# EasyEDA Pro project ProPrj_Trimix_2026-09-05.epro

# Schematic Kretskort

## Sheets
1 ESP-32S: Board Name: Board v1; Create Date: 2025-07-03; Page Name: ESP-32S; Project Name: Trimix; Schematic Name: Schematic1; Update Date: 2026-01-29; Company: MAGSON; Page Size: A4; Version: V1.0
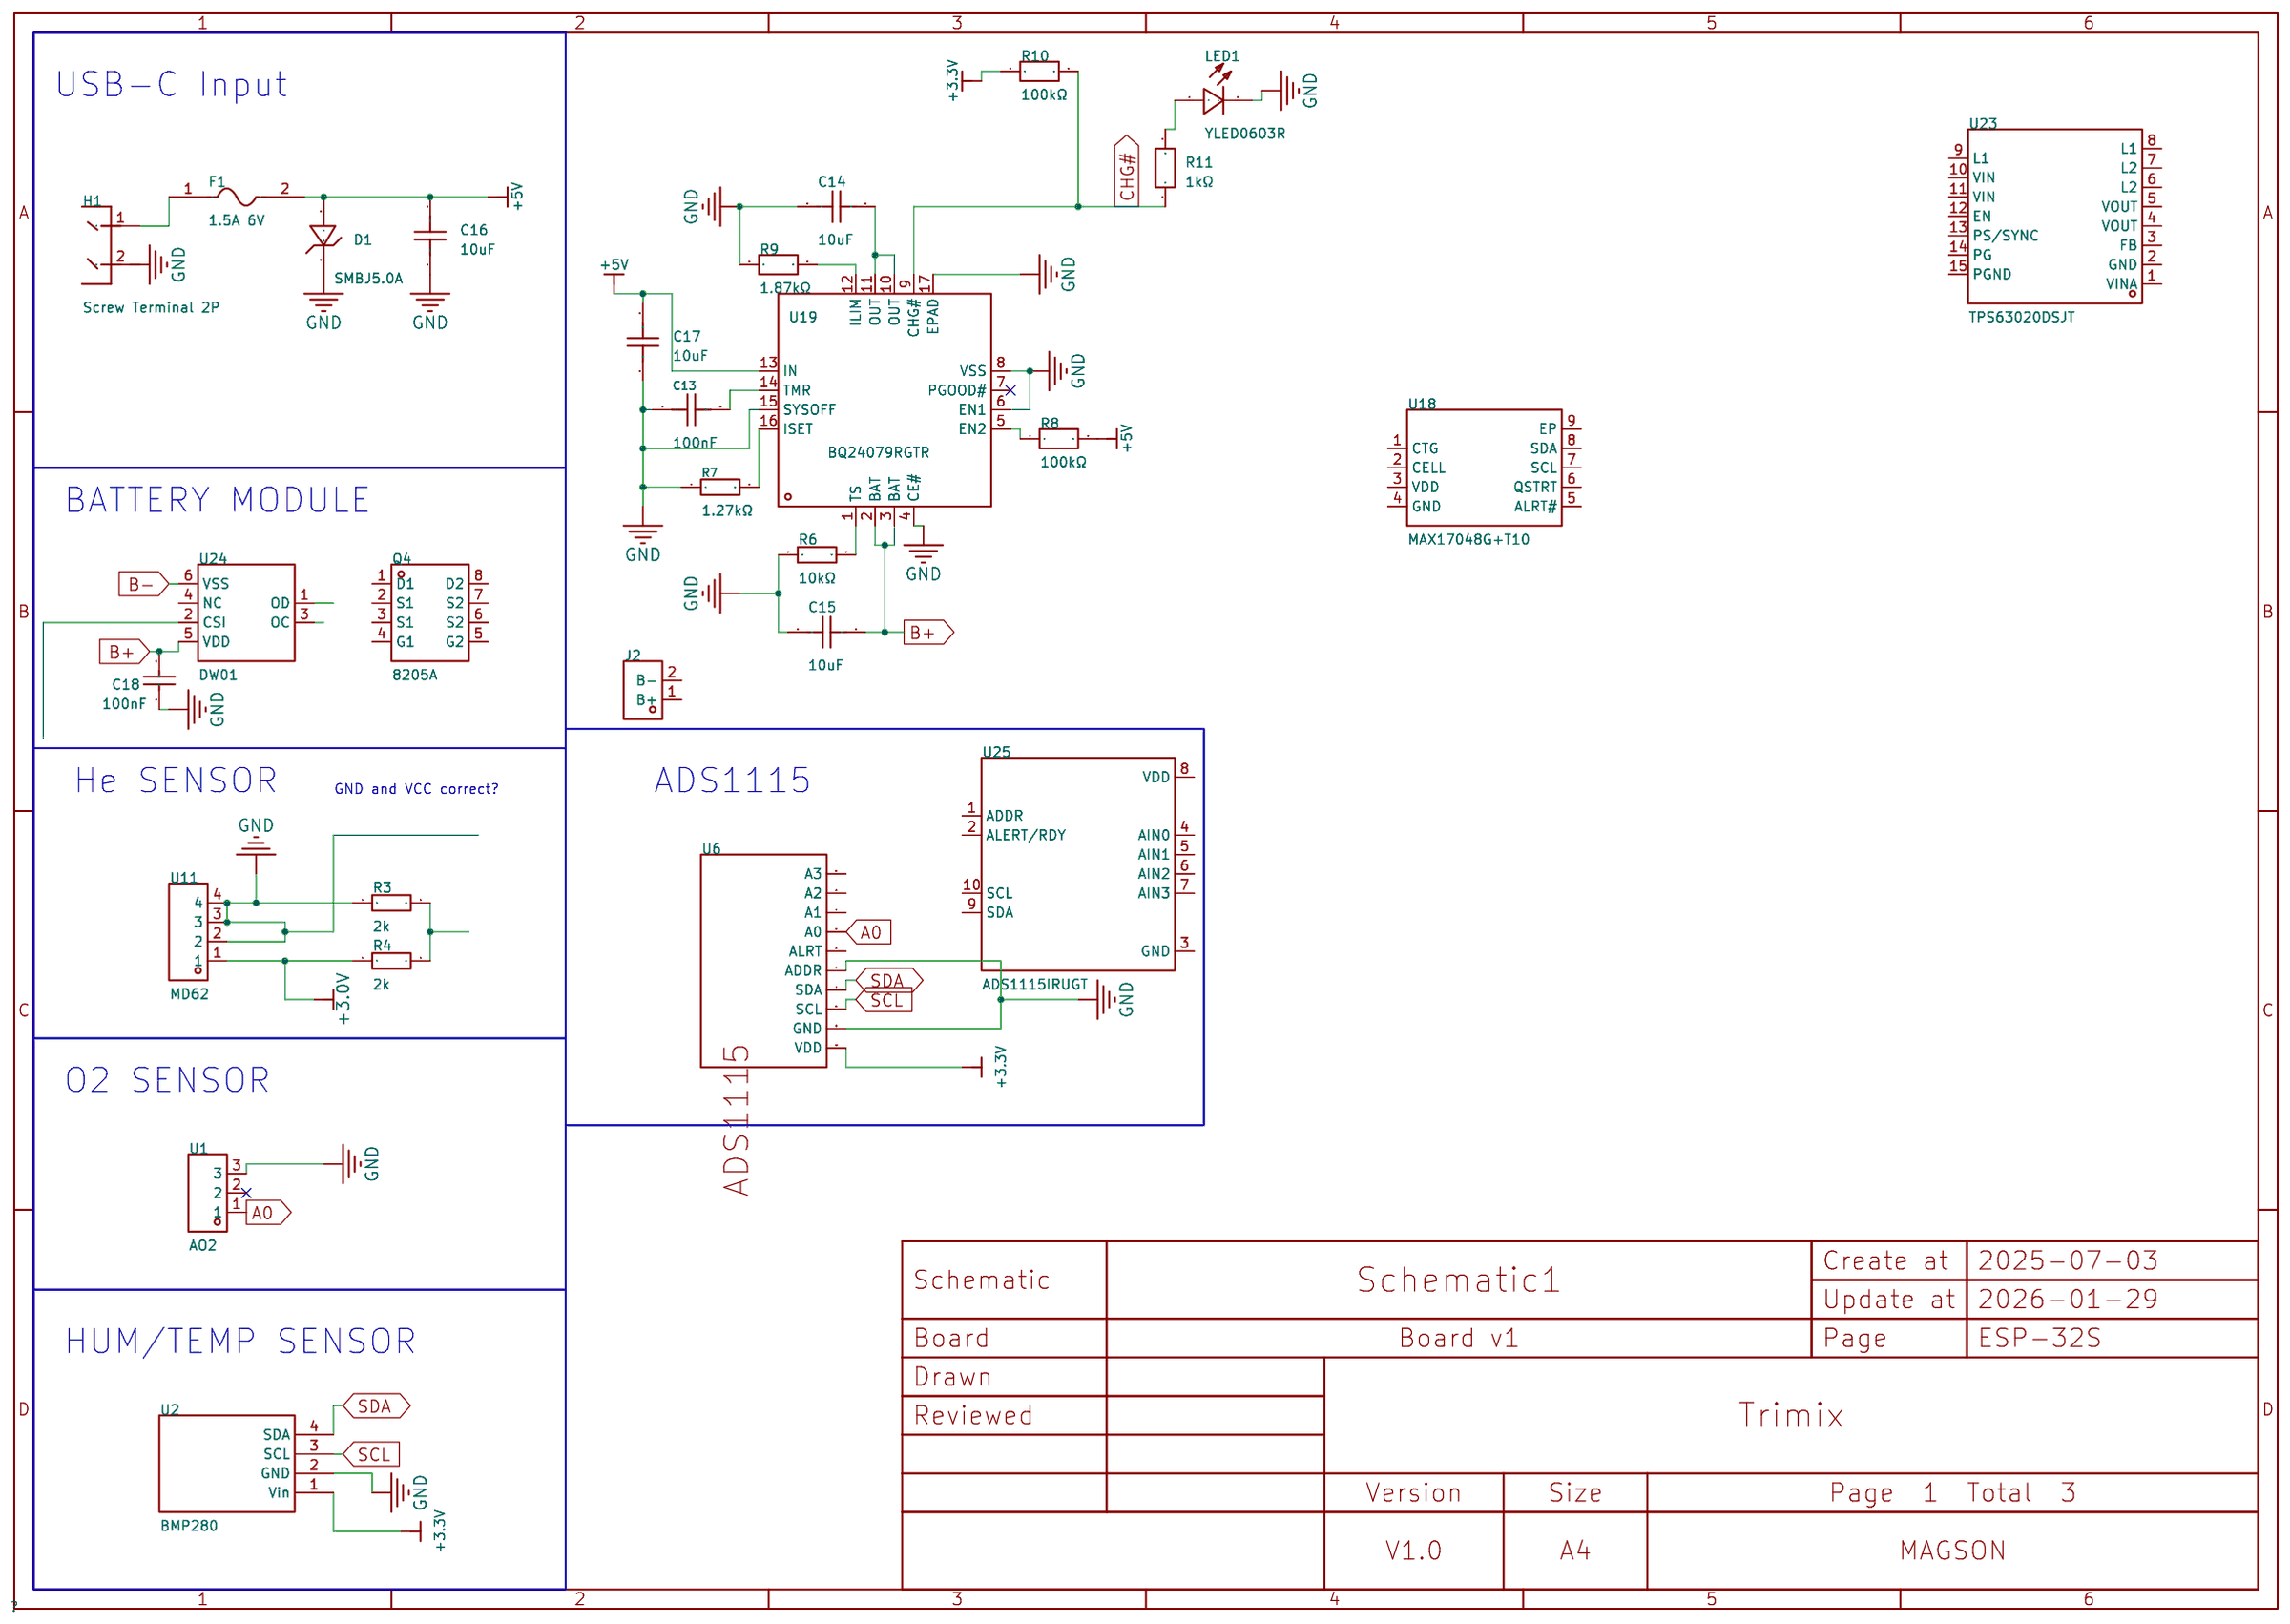
[diagram p0: ESP-32S]
2 Arduino nano_1: Board Name: Board1; Page Name: Arduino nano; Update Date: 2025-07-05; Company: EasyEDA.com
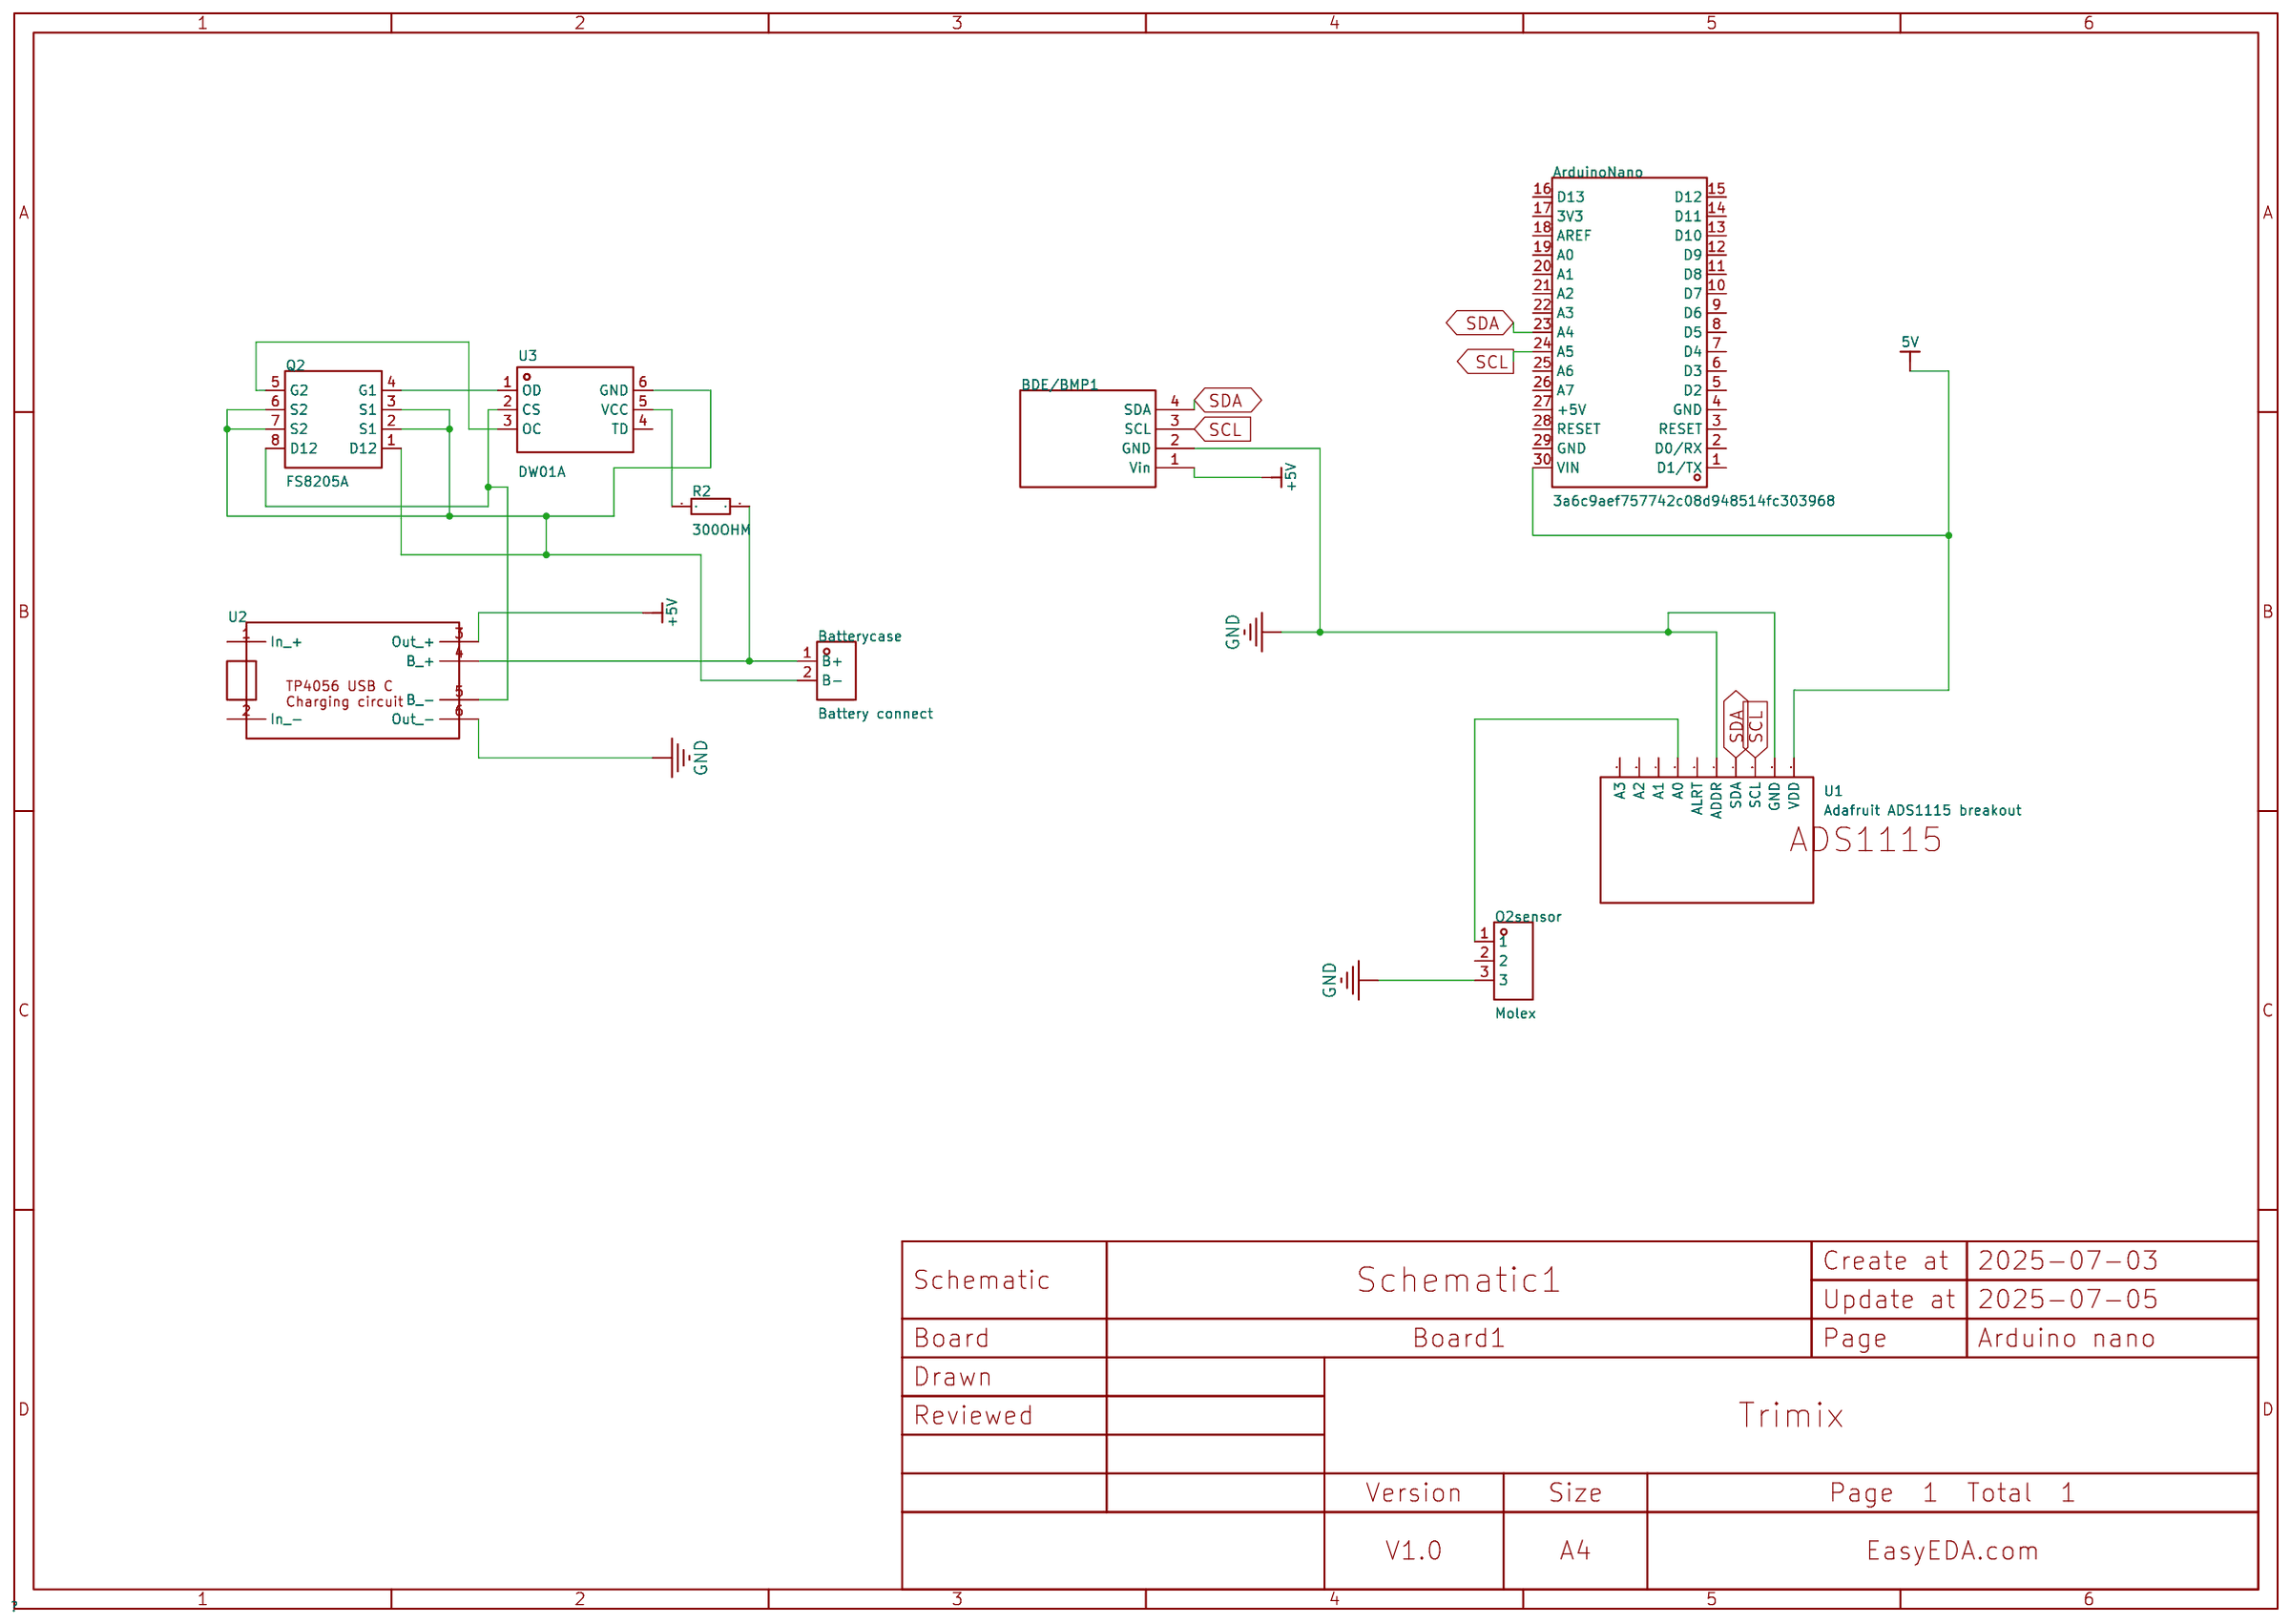
[diagram p1: Arduino nano_1]
3 ESP-32S backup
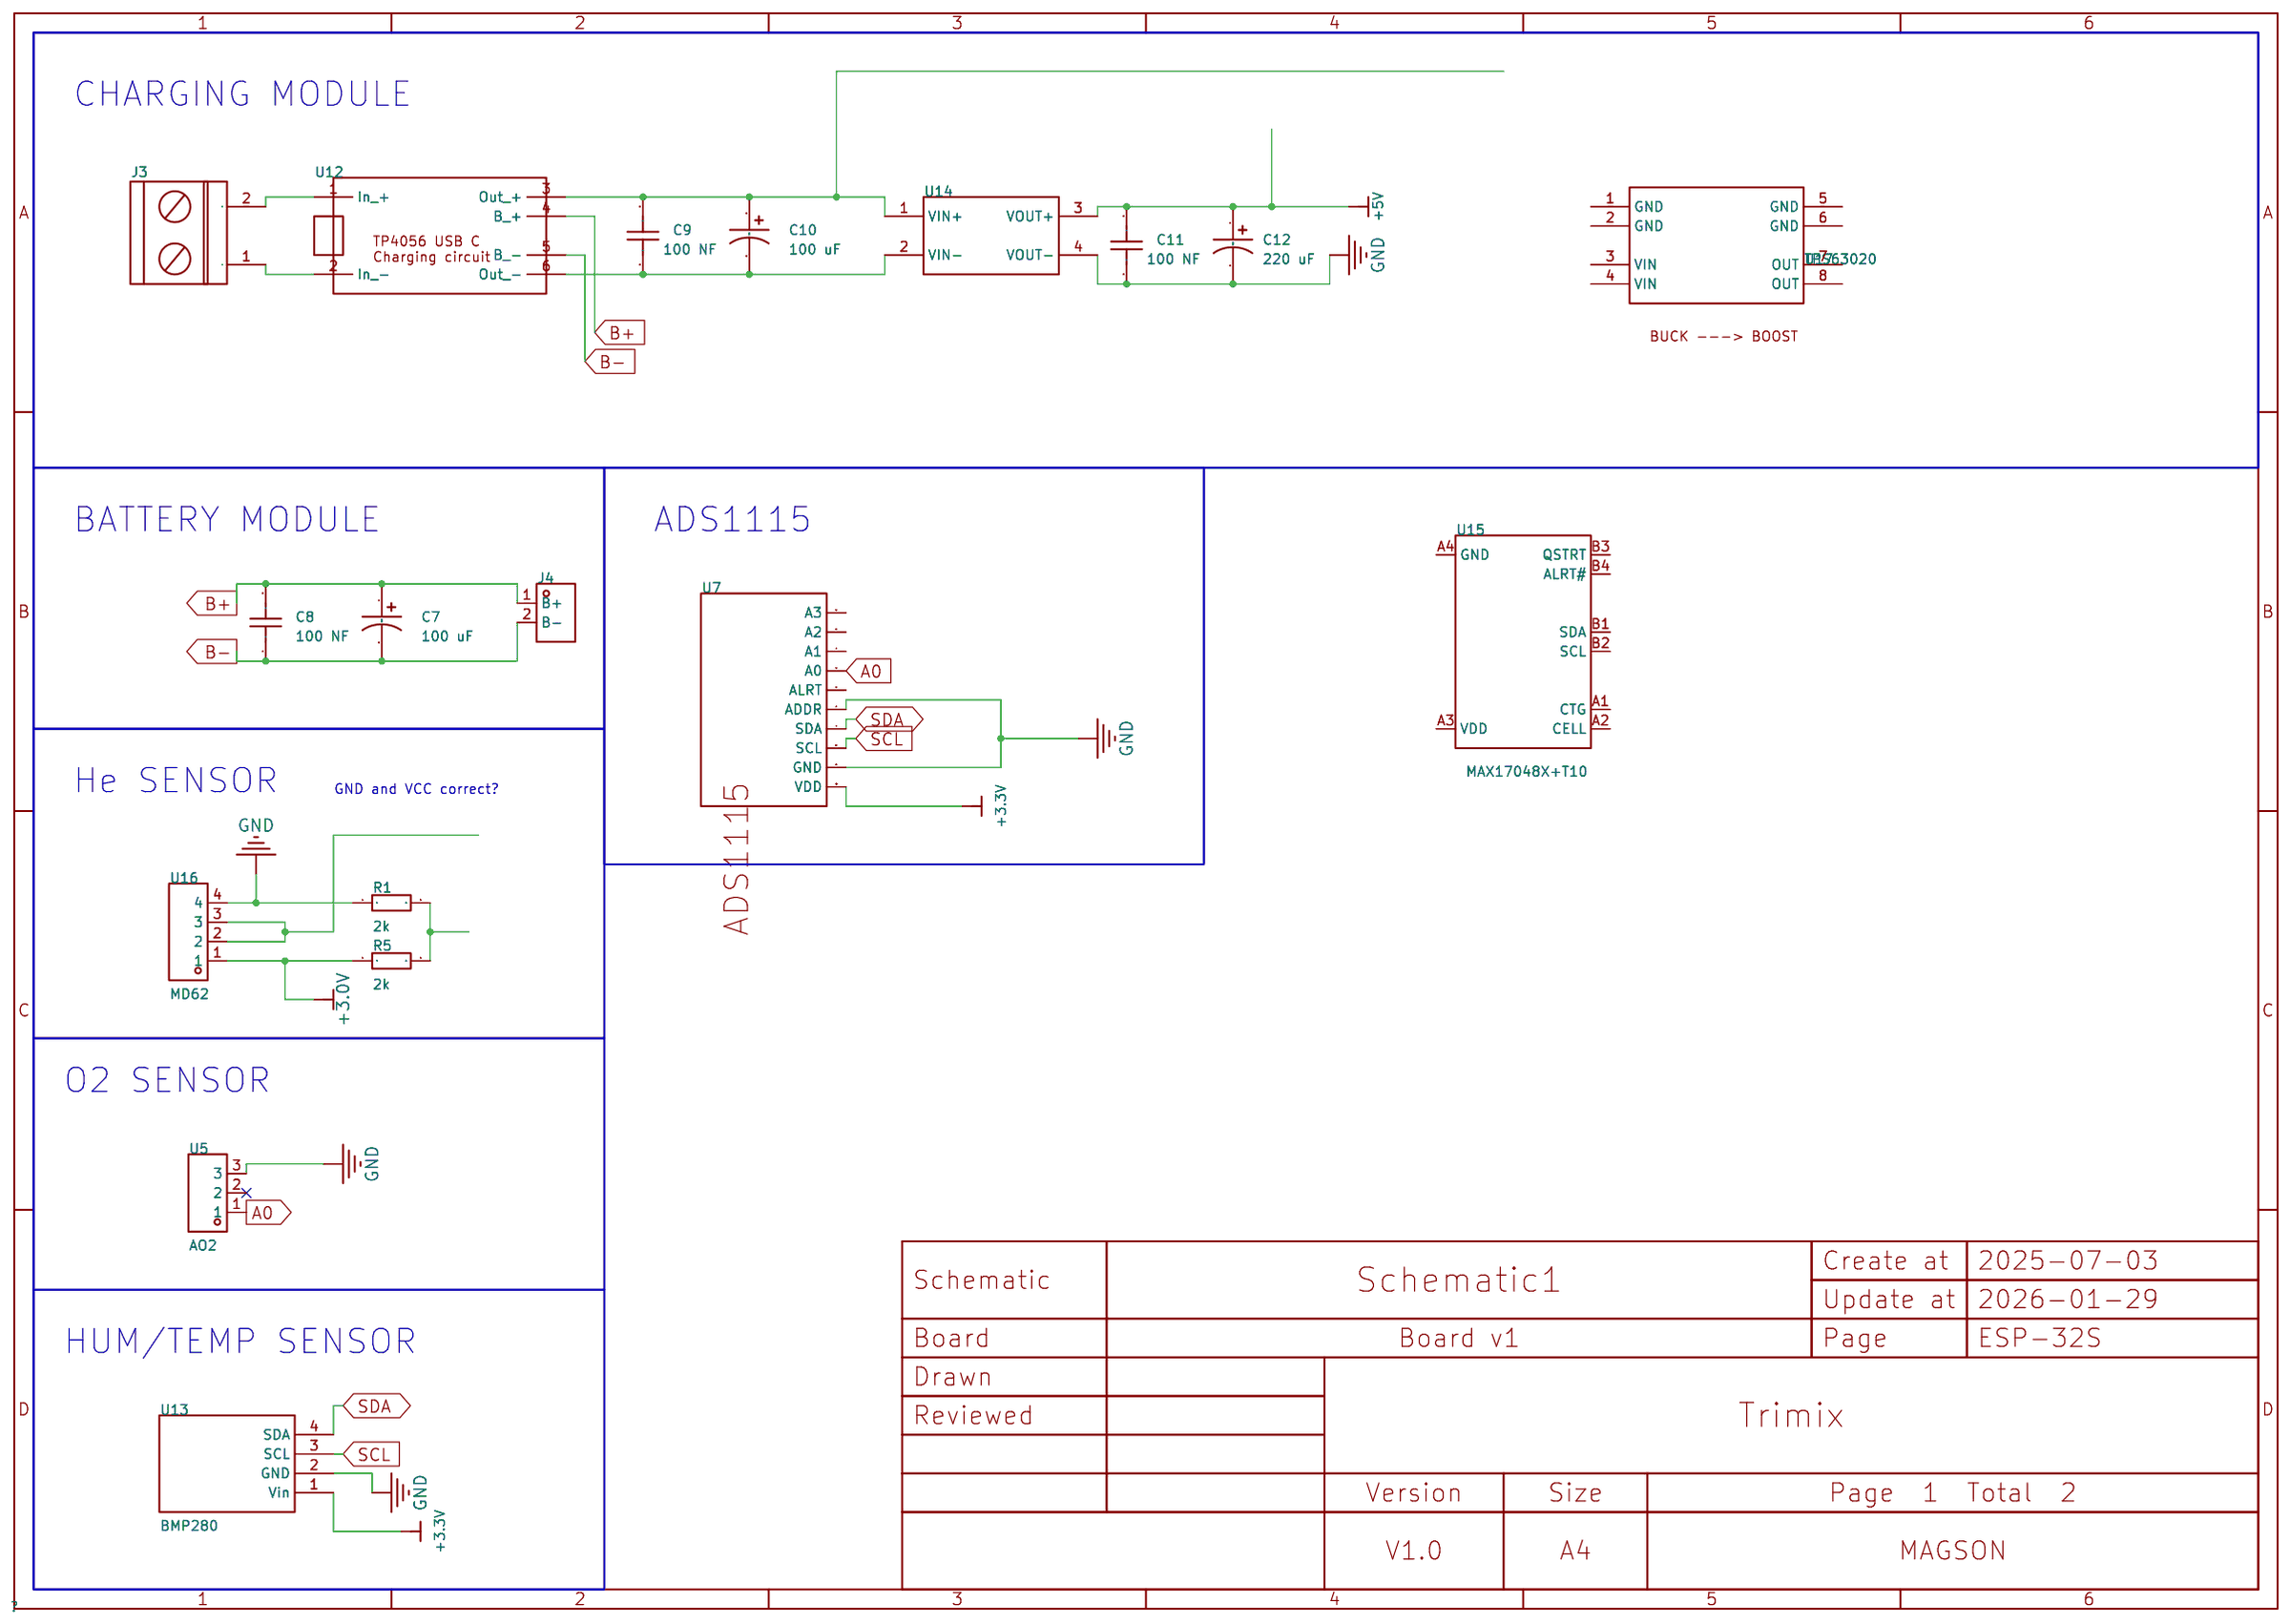
[diagram p2: ESP-32S backup]

## Parts
sheet Arduino nano_1
ArduinoNano  3a6c9aef757742c08d948514fc303968  [COMM-TH_ARDUINO_NANO]
Batterycase  Battery connect  [CONN-TH_P3.50_KF128L-3.5-2P]
BDE/BMP1  -  [BME/BMP280]
O2sensor  Molex  [HDR-TH_3P-P2.54-V-M-1]
Q2  FS8205A  [TSSOP-8_L4.4-W3.5-P0.65-LS6.4-BL]
R2  300OHM  [Resistor 1/8w 7mm metal film]
U1#2  Adafruit ADS1115 breakout  [ADAFRUIT ADS1115]
U2#2  -  [PWRM-TH_TP4056]
U3  DW01A  [SOT95P280X135-6N_DW01A]
sheet ESP-32S backup
C7  100 uF  [CAP-TH_BD10.0-P5.00-D0.6-FD]
C8  100 NF  [C0603]
C9  100 NF  [C0603]
C10  100 uF  [CAP-TH_BD10.0-P5.00-D0.6-FD]
C11  100 NF  [C0603]
C12  220 uF  [CAP-TH_BD10.0-P5.00-D0.6-FD]
J3  -  [SCREW TERMINAL BLOCK 5MM 2PIN univ]
J4  KF128L-3.5-2P  [CONN-TH_P3.50_KF128L-3.5-2P]
R1  2k  [Resistor 1/8w 7mm metal film]
R5  2k  [Resistor 1/8w 7mm metal film]
U5  AO2  [HDR-TH_3P-P2.54-V-M-1]
U7  Adafruit ADS1115 breakout  [ADAFRUIT ADS1115]
U12  -  [PWRM-TH_TP4056]
U13  BMP280  [BME/BMP280]
U14  -
U15  MAX17048X+T10  [CSP-8_L1.7-W0.9-R2-C4-P0.40-TL]
U16  MD62  [SENSORS-TH_MD62]
U17  TPS63020
sheet ESP-32S
C13  100nF  [C0402]
C14  10uF  [C0603]
C15  10uF  [C0603]
C16  10uF  [C0603]
C17  10uF  [C0603]
C18  100nF  [C0603]
D1  SMBJ5.0A  [SMB_L4.6-W3.6-LS5.3-RD]
F1  1.5A 6V  [F1206]
H1  Screw Terminal 2P  [2 PIN 2.54MM PITCH CONNECTOR2]
J2  KF128L-3.5-2P  [CONN-TH_P3.50_KF128L-3.5-2P]
LED1  YLED0603R  [LED0603-FD]
Q4  8205A  [TSSOP-8_L4.4-W3.0-P0.65-LS6.4-BL]
R3  2k  [Resistor 1/8w 7mm metal film]
R4  2k  [Resistor 1/8w 7mm metal film]
R6  10kΩ  [R0603]
R7  1.27kΩ  [R0603]
R8  100kΩ  [R0603]
R9  1.87kΩ  [R0603]
R10  100kΩ  [R0603]
R11  1kΩ  [R0603]
U1  AO2  [HDR-TH_3P-P2.54-V-M-1]
U2  BMP280  [BME/BMP280]
U6  Adafruit ADS1115 breakout  [ADAFRUIT ADS1115]
U11  MD62  [SENSORS-TH_MD62]
U18  MAX17048G+T10  [TDFN-8_L2.0-W2.0-P0.50-BL-EP1.2]
U19  BQ24079RGTR  [QFN-16_L3.0-W3.0-P0.50-TL-EP]
U23  TPS63020DSJT  [VSON-14_L4.0-W3.0-P0.50-BL-EP_TI_DSJ]
U24  DW01  [TSOT-23-6_L2.9-W1.6-P0.95-LS2.8-BL]
U25  ADS1115IRUGT  [X2QFN-10_L2.0-W1.5-P0.50-TL_RUG0010B]

## Library data of the parts
ArduinoNano = Arduino Nano: Nano V3-Board Mikrocontroller Atmega328 CH340; Manufacturer: AZDelivery; Manufacturer Part: Nano V3 CH340; Supplier: AZDelivery
Batterycase J2 J4 = KF128L-3.5-2P: Pitch:3.5mm Number of Rows:1 Number of PINs Per Row:2 Mounting Style:直针 Current Rating (Max):10A Voltage Rating (Max):300V Wire Gauge - AWG:16~26 Wire Gauge - mm?:1 Operating Temperature Range:-40℃~+105℃ Operating Temperature Range:-40℃~+105℃ Color:Green; LCSC Part Name: 3.5mm 排数:1 每排P数:2 直针 可拼接 铜 环保; Supplier Part: C474930; Manufacturer: KEFA(科发); Supplier Footprint: 直插,P=3.5mm; JLCPCB Part Class: Extended Part; Datasheet: https://atta.szlcsc.com/upload/public/pdf/source/20200115/C474930_99E88C734F0367C4F80443B58FE9D8B8.pdf; Supplier: LCSC; Pitch: 3.5mm; Number of Rows: 1; Number of PINs Per Row: 2; Mounting Style: 直针; Current Rating (Max): 10A; Voltage Rating (Max): 300V; Wire Gauge - AWG: 16~26; Wire Gauge - mm?: 1; Operating Temperature Range: -40℃~+105℃; Color: Green
BDE/BMP1 U2 U13 = BME/BMP280
O2sensor U1 U5 = 2.54mm-1*3P 直针: Supplier Part: C9900025313; Supplier Footprint: 2.54-180-3P; JLCPCB Part Class: Extended Part; Supplier: LCSC
Q2 = FS8205A: Supplier: LCSC; Manufacturer: FORTUNE; image: //image.lceda.cn/szlcsc/C16052.jpg; Supplier Part: C16052; JLCPCB Part Class: Basic; JLCPCB SMD: Yes; Paste Type: base
R1-R5 = resistor: Supplier: LCSC; Manufacturer: UNI-ROYAL(Uniroyal Elec); Manufacturer Part: 1206W4F1002T5E; Supplier Part: C17902; Resistance: 10KΩ; JLCPCB Part Class: Basic Part; Datasheet: https://datasheet.lcsc.com/lcsc/2206010145_UNI-ROYAL-Uniroyal-Elec-1206W4F1002T5E_C17902.pdf
U1#2 U6 U7 = Adafruit ADS1115 breakout: Manufacturer: Adafruit; Manufacturer Part: 1085; link: https://www.adafruit.com/product/1085
U2#2 U12 = TP4056 USB C
U3 = DW01A: Supplier: LCSC; Manufacturer: PUOLOP; Supplier Part: C351410
C7 C10 C12 = GDW02R7K106L1025RD: Capacitance:10F Tolerance:-10%~30% Tolerance:-10%~30% Voltage Rating:2.7V; LCSC Part Name: 10F -10%~30% 2.7V; Supplier Part: C46550329; Manufacturer: GODETEK(皋德科技); Supplier Footprint: 插件,D10xL25mm; Datasheet: https://item.szlcsc.com/datasheet/GDW02R7K106L1025RD/48680022.html; Supplier: LCSC; Tolerance: -10%~30%; Voltage Rating: 2.7V
C8 C9 C11 = C0603C103K5RACTU KEMET Ceramic Capacitor: Supplier Part: C28056281; Supplier Footprint: 0603; Supplier: LCSC
J3 = TERMINAL BLOCK 5MM 2PIN univ: Manufacturer Part: Screw Terminal Block 5mm 2 pin
U14 = MT3608: MT3608 Power Module with Adjustable Voltages Regulator Short Circuits Protections Overcurrent Protections
U15 = MAX17048X+T10: Voltage - Supply:2.5V~4.5V Voltage - Supply:2.5V~4.5V Type of Battery:Lithium Battery Number of Cells:1 Number of Cells:1 Operating Temperature:-40℃~+85℃ Operating Temperature:-40℃~+85℃ Battery Temperature Detection:Not Supported Supply Current (Iq):3uA I; LCSC Part Name: 采用ModelGauge技术，3μA单节/双节电池电量计; Supplier Part: C7497002; Manufacturer: ADI(亚德诺)/MAXIM(美信); Supplier Footprint: WLP-8(0.9x1.8); JLCPCB Part Class: Extended Part; Datasheet: https://item.szlcsc.com/datasheet/MAX17048X%252BT10/8564309.html; Supplier: LCSC; Voltage - Supply: 2.5V~4.5V; Type of Battery: Lithium Battery; Number of Cells: 1; Operating Temperature: -40℃~+85℃; Battery Temperature Detection: Not Supported; Supply Current (Iq): 3uA; Interface: I2C
U11 U16 = MD62: Supplier Part: C9900091627; Supplier Footprint: 插件 金属封装; Supplier: LCSC
U17 = TPS63020
C13 = CC0402KRX7R7BB104: Capacitance: Tolerance:±10% Tolerance:±10% Voltage Rated: Temperature Coefficient:; LCSC Part Name: 100nF ±10% 16V; Supplier Part: C60474; Manufacturer: YAGEO(国巨); Supplier Footprint: 0402; JLCPCB Part Class: Extended Part; Datasheet: https://atta.szlcsc.com/upload/public/pdf/source/20211223/9278FD768280B81DDBEF48FA36411A03.pdf; Supplier: LCSC; Tolerance: ±10%
C14-C17 = CL10A106MQ8NNNC: Capacitance:10uF Tolerance:±20% Tolerance:±20% Voltage Rating:6.3V Temperature Coefficient:X5R; LCSC Part Name: 10uF ±20% 6.3V; Supplier Part: C1691; Manufacturer: SAMSUNG(三星); Supplier Footprint: 0603; JLCPCB Part Class: Extended Part; Datasheet: https://item.szlcsc.com/datasheet/CL10A106MQ8NNNC/2043.html; Supplier: LCSC; Tolerance: ±20%; Voltage Rating: 6.3V; Temperature Coefficient: X5R
C18 = 0603B104K500NT_C30926: Capacitance:100nF Tolerance:±10% Tolerance:±10% Voltage Rating:50V Temperature Coefficient:X7R; LCSC Part Name: 100nF ±10% 50V; Supplier Part: C30926; Manufacturer: FH(风华); Manufacturer Part: 0603B104K500NT; Supplier Footprint: 0603; JLCPCB Part Class: Extended Part; Datasheet: https://item.szlcsc.com/datasheet/0603B104K500NT/31683.html; Supplier: LCSC; Tolerance: ±10%; Voltage Rating: 50V; Temperature Coefficient: X7R
D1 = SMBJ5.0A: Reverse Stand-Off Voltage (Vrwm):5V Maximum Clamping Voltage:9.2V Peak Pulse Current (Ipp)@10/1000us:65.3A Breakdown Voltage:6.4V Type:TVS; Supplier Part: C127544; Supplier Footprint: SMB(DO-214AA); JLCPCB Part Class: Extended Part; Datasheet: https://atta.szlcsc.com/upload/public/pdf/source/20190828/C415856_91585ADD1001807004044059320FFAFB.pdf; Supplier: LCSC; Reverse Stand-Off Voltage (Vrwm): 5V; Maximum Clamping Voltage: 9.2V; Peak Pulse Current (Ipp)@10/1000us: 65.3A; Breakdown Voltage: 6.4V; Type: TVS
F1 = ASMD1206-020: Supplier Part: C9900027127; Supplier Footprint: FUSE1206; JLCPCB Part Class: Extended Part; Supplier: LCSC
H1 = Screw Terminal 2-Pin (KF128-2.54mm Pitch): Manufacturer: Kefa; Manufacturer Part: KF128-2.54-2P; link: http://en.cnkefa.com/uploads/2016/07/071521073799.pdf
LED1 = YLED0603R: Lamp Holder Type:-；- Illumination Color:Red Voltage - Forward(Vf):1.8V~2.4V Voltage - Forward(Vf):1.8V~2.4V Power(Watts):- Forward Current:25mA Wavelength - Dominant:620nm~625nm Wavelength - Dominant:620nm~625nm Peak Wavelength:- Diode Configuration:Discr; LCSC Part Name: 红色 独立二极管; Supplier Part: C19171390; Manufacturer: YONGYUTAI(永裕泰); Supplier Footprint: 0603; JLCPCB Part Class: Extended Part; Datasheet: https://item.szlcsc.com/datasheet/YLED0603R/20382441.html; Supplier: LCSC; Lamp Holder Type: -；-; Illumination Color: Red; Voltage - Forward(Vf): 1.8V~2.4V; Forward Current: 25mA; Wavelength - Dominant: 620nm~625nm; Diode Configuration: Discrete Diode; Luminous Intensity: 120mcd; Viewing Angle: 120°; Operating Temperature: -40℃~+85℃
Q4 = 8205A_C7499846: Number:2 N-Channel Drain to Source Voltage:19.5V Current - Continuous Drain(Id):4.5A RDS(on):19mΩ@4.5V Pd - Power Dissipation:1.2W Gate Threshold Voltage (Vgs(th)):700mV@250uA Gate Charge(Qg):6.1nC@4.5V Input Capacitance(Ciss):465pF Reverse Transfer Capac; LCSC Part Name: 2个N沟道 耐压:19.5V 电流:4.5A; Supplier Part: C7499846; Manufacturer: HL(富海微); Supplier Footprint: TSSOP-8; JLCPCB Part Class: Extended Part; Datasheet: https://item.szlcsc.com/datasheet/8205A/8575672.html; Supplier: LCSC; Number: 2 N-Channel; Drain to Source Voltage: 19.5V; Current - Continuous Drain(Id): 4.5A; RDS(on): 19mΩ@4.5V; Pd - Power Dissipation: 1.2W; Gate Threshold Voltage (Vgs(th)): 700mV@250uA; Gate Charge(Qg): 6.1nC@4.5V; Input Capacitance(Ciss): 465pF; Reverse Transfer Capacitance (Crss@Vds): 76pF; Operating Temperature: -55℃~+150℃; Output Capacitance(Coss): 99pF
R6 = 0603WAF6201T5E: Type:Thick Film Resistor Resistance:6.2kΩ Tolerance:±1% Tolerance:±1% Power(Watts):100mW Voltage-Supply(Max):75V Temperature Coefficient:±100ppm/℃ Temperature Coefficient:±100ppm/℃ Operating Temperature:-55℃~+155℃ Operating Temperature:-55℃~+155℃; LCSC Part Name: 6.2kΩ ±1% 100mW 厚膜电阻; Supplier Part: C4260; Manufacturer: UNI-ROYAL(厚声); Supplier Footprint: 0603; JLCPCB Part Class: Basic Part; Datasheet: https://item.szlcsc.com/datasheet/0603WAF6201T5E/4667.html; Supplier: LCSC; Type: Thick Film Resistor; Tolerance: ±1%; Power(Watts): 100mW; Voltage-Supply(Max): 75V; Temperature Coefficient: ±100ppm/℃; Operating Temperature: -55℃~+155℃
R7 = 0603WAF1271T5E: Type:Thick Film Resistor Resistance:1.27kΩ Tolerance:±1% Tolerance:±1% Power(Watts):100mW Voltage-Supply(Max):75V Temperature Coefficient:±100ppm/℃ Temperature Coefficient:±100ppm/℃ Operating Temperature:-55℃~+155℃ Operating Temperature:-55℃~+155℃; LCSC Part Name: 1.27kΩ ±1% 100mW 厚膜电阻; Supplier Part: C22836; Manufacturer: UNI-ROYAL(厚声); Supplier Footprint: 0603; JLCPCB Part Class: Extended Part; Datasheet: https://item.szlcsc.com/datasheet/0603WAF1271T5E/23563.html; Supplier: LCSC; Type: Thick Film Resistor; Tolerance: ±1%; Power(Watts): 100mW; Voltage-Supply(Max): 75V; Temperature Coefficient: ±100ppm/℃; Operating Temperature: -55℃~+155℃
R8 R10 R11 = FRC0603J104 TS: Type:Thick Film Resistor Resistance:100kΩ Tolerance:±5% Tolerance:±5% Power(Watts):100mW Voltage-Supply(Max):75V Temperature Coefficient:±100ppm/℃ Temperature Coefficient:±100ppm/℃ Operating Temperature:-55℃~+155℃ Operating Temperature:-55℃~+155℃; LCSC Part Name: 100kΩ ±5% 100mW 厚膜电阻; Supplier Part: C2907088; Manufacturer: FOJAN(富捷); Supplier Footprint: 0603; JLCPCB Part Class: Extended Part; Supplier: LCSC; Type: Thick Film Resistor; Tolerance: ±5%; Power(Watts): 100mW; Voltage-Supply(Max): 75V; Temperature Coefficient: ±100ppm/℃; Operating Temperature: -55℃~+155℃
R9 = FRC0603F1871TS: Type:Thick Film Resistor Resistance:1.87kΩ Tolerance:±1% Tolerance:±1% Power(Watts):100mW Voltage-Supply(Max):75V Temperature Coefficient:±100ppm/℃ Temperature Coefficient:±100ppm/℃ Operating Temperature:-55℃~+155℃ Operating Temperature:-55℃~+155℃; LCSC Part Name: 1.87kΩ ±1% 100mW 厚膜电阻; Supplier Part: C2930054; Manufacturer: FOJAN(富捷); Supplier Footprint: 0603; JLCPCB Part Class: Extended Part; Supplier: LCSC; Type: Thick Film Resistor; Tolerance: ±1%; Power(Watts): 100mW; Voltage-Supply(Max): 75V; Temperature Coefficient: ±100ppm/℃; Operating Temperature: -55℃~+155℃
U18 = MAX17048G+T10: The Chip Type:Battery monitoring chip Voltage - Supply:2.5V~4.5V Voltage - Supply:2.5V~4.5V Type of Battery:Lithium-ion/Polymer Number of Cells:1 Number of Cells:1 Operating Temperature:-40℃~+85℃ Operating Temperature:-40℃~+85℃; LCSC Part Name: 单节/双节电池电量计使用ModelGauge技术; Supplier Part: C2682616; Manufacturer: ADI(亚德诺)/MAXIM(美信); Supplier Footprint: DFN-8-EP(2x2); JLCPCB Part Class: Extended Part; Datasheet: https://item.szlcsc.com/datasheet/MAX17048G%252BT10/2777647.html; Supplier: LCSC; The Chip Type: Battery monitoring chip; Voltage - Supply: 2.5V~4.5V; Type of Battery: Lithium-ion/Polymer; Number of Cells: 1; Operating Temperature: -40℃~+85℃
U19 = BQ24079RGTR: The Chip Type:Charging IC Voltage - Supply:4.35V~6.6V Voltage - Supply:4.35V~6.6V Charge Current - Max:1.5A Charging Saturation Voltage:4.1V Type of Battery:Lithium Battery Number of Cells:- Number of Cells:- Operating Temperature:-40℃~+125℃ Operating Tem; LCSC Part Name: bq2407x 1.5-A USB友好型锂离子电池充电器和电源路径管理IC; Supplier Part: C140287; Manufacturer: TI(德州仪器); Supplier Footprint: QFN-16-EP(3x3); JLCPCB Part Class: Extended Part; Datasheet: https://www.ti.com/cn/lit/gpn/bq24079; Supplier: LCSC; The Chip Type: Charging IC; Voltage - Supply: 4.35V~6.6V; Charge Current - Max: 1.5A; Charging Saturation Voltage: 4.1V; Type of Battery: Lithium Battery; Operating Temperature: -40℃~+125℃; Battery Temperature Detection: Support
U23 = TPS63020DSJT: Function:Buck-Boost Voltage - Supply:1.8V~5.5V Voltage - Supply:1.8V~5.5V Output Voltage:1.2V~5.5V Output Voltage:1.2V~5.5V Output Current:2A Frequency - Switching:2.4MHz Frequency - Switching:2.4MHz Operating Temperature:-40℃~+125℃@(TJ) Operating Tempera; LCSC Part Name: 具有4A开关的高效率单电感器降压/升压转换器; Supplier Part: C544952; Manufacturer: TI(德州仪器); Supplier Footprint: VSON-14-EP(3x4); JLCPCB Part Class: Extended Part; Datasheet: https://www.ti.com/cn/lit/gpn/tps63021; Supplier: LCSC; Function: Buck-Boost; Voltage - Supply: 1.8V~5.5V; Output Voltage: 1.2V~5.5V; Output Current: 2A; Frequency - Switching: 2.4MHz; Operating Temperature: -40℃~+125℃@(TJ); Synchronous Rectifier: Yes; Number of Outputs: 1; Topology: Buck-Boost; Quiescent Current: 25uA; Switch tube (built-in/external): Built-in; Output Type: Adjustable
U24 = DW01_C22386161: LCSC Part Name: 锂电池保护IC; Supplier Part: C22386161; Manufacturer: SHIKUES(时科); Supplier Footprint: SOT-23-6; JLCPCB Part Class: Extended Part; Datasheet: https://atta.szlcsc.com/upload/public/pdf/source/20240510/652D16FF2181B013959112EA6E1F443B.pdf; Supplier: LCSC
U25 = ADS1115IRUGT: Resolution(Bits):16 Sampling Rate:860Hz number of channels:2 Voltage - Supply:2V~5.5V Voltage - Supply:2V~5.5V Interface:I2C differential input:Yes Integral non - linearity:1LSB Integral non - linearity:1LSB Operating Temperature:-40℃~+125℃ Operating Temp; LCSC Part Name: 具有内部基准、振荡器和可编程比较器且兼容 I2C 的ADS111x、超小型、低功耗 860SPS、16位ADC; Supplier Part: C701611; Manufacturer: TI(德州仪器); Supplier Footprint: X2QFN-10(1.5x2); JLCPCB Part Class: Extended Part; Datasheet: https://www.ti.com/cn/lit/gpn/ads1114; Supplier: LCSC; Resolution(Bits): 16; Sampling Rate: 860Hz; number of channels: 2; Voltage - Supply: 2V~5.5V; Interface: I2C; differential input: Yes; Integral non - linearity: 1LSB; Operating Temperature: -40℃~+125℃; Clock/Oscillator: Built-in; Clock Frequency: 1MHz; Voltage Reference: Built-in; Programmable Gain: Support; ADC architecture: Sigma-Delta; Data rate: 128Hz；8Hz；64Hz；16Hz；32Hz；250Hz；475Hz；860Hz; Quiescent Current (Iq): 500nA; Full-Scale Range(FSR): 6.144V

## Nets
5V: ArduinoNano.30(VIN) U1#2.10(VDD)
+3.0V: R4.1 R5.1 U11.1 U16.1
+3.3V: R10.2 U2.1(Vin) U6.10(VDD) U7.10(VDD) U13.1(Vin)
+5V: BDE/BMP1.1(Vin) C11.2 C12.1 C16.2 C17.2 D1.2(A) F1.2 R8.2 U2#2.3(Out +) U14.3(VOUT+) U19.13(IN)
GND: BDE/BMP1.2(GND) C11.1 C12.2 C13.1 C14.1 C15.1 C16.1 C17.1 C18.1 D1.1(C) H1.2 LED1.2(-) O2sensor.3 R1.1 R3.1 R6.1 R7.1 R9.1 U1.3 U1#2.1(ADDR) U1#2.9(GND) U2.2(GND) U2#2.6(Out -) U5.3 U6.1(ADDR) U6.9(GND) U7.1(ADDR) U7.9(GND) U11.2 U11.3 U11.4 U13.2(GND) U14.4(VOUT-) U16.4 U19.4(CE#) U19.6(EN1) U19.8(VSS) U19.15(SYSOFF) U19.17(EPAD)
A0: U1.1 U5.1 U6.3(A0) U7.3(A0)
B+: C7.1 C8.2 C15.2 C18.2 J4.1(B+) U12.4(B +) U19.2(BAT) U19.3(BAT) U24.5(VDD)
B-: C7.2 C8.1 J4.2(B-) U12.5(B -) U24.6(VSS)
CHG#: R10.1 R11.1 U19.9(CHG#)
SCL: ArduinoNano.24(A5) BDE/BMP1.3(SCL) U1#2.8(SCL) U2.3(SCL) U6.8(SCL) U7.8(SCL) U13.3(SCL)
SDA: ArduinoNano.23(A4) BDE/BMP1.4(SDA) U1#2.7(SDA) U2.4(SDA) U6.7(SDA) U7.7(SDA) U13.4(SDA)
Net-(Batterycase-1): Batterycase.1(B+) R2.2 U2#2.4(B +)
Net-(Batterycase-2): Batterycase.2(B-) Q2.1(D12) Q2.2(S1) Q2.3(S1) Q2.6(S2) Q2.7(S2) U3.6(GND)
Net-(C9-1): C9.1 C10.2 U12.6(Out -) U14.2(VIN-)
Net-(C9-2): C9.2 C10.1 U12.3(Out +) U14.1(VIN+)
Net-(C13-2): C13.2 U19.14(TMR)
Net-(C14-2): C14.2 U19.10(OUT) U19.11(OUT)
Net-(F1-1): F1.1 H1.1
Net-(J3-1): J3.1(-) U12.2(In -)
Net-(J3-2): J3.2(+) U12.1(In +)
Net-(LED1-1): LED1.1(+) R11.2
Net-(O2sensor-1): O2sensor.1 U1#2.3(A0)
Net-(Q2-4): Q2.4(G1) U3.1(OD)
Net-(Q2-5): Q2.5(G2) U3.3(OC)
Net-(Q2-8): Q2.8(D12) U2#2.5(B -) U3.2(CS)
Net-(R1-2): R1.2 R5.2
Net-(R2-1): R2.1 U3.5(VCC)
Net-(R3-2): R3.2 R4.2
Net-(R6-2): R6.2 U19.1(TS)
Net-(R7-2): R7.2 U19.16(ISET)
Net-(R8-1): R8.1 U19.5(EN2)
Net-(R9-2): R9.2 U19.12(ILIM)
Net-(U16-2): U16.2 U16.3

Not connected (* = marked no-connect by the designer): ArduinoNano 1(D1/TX) 2(D0/RX) 3(RESET) 4(GND) 5(D2) 6(D3) 7(D4) 8(D5) 9(D6) 10(D7) 11(D8) 12(D9) 13(D10) 14(D11) 15(D12) 16(D13) 17(3V3) 18(AREF) 19(A0) 20(A1) 21(A2) 22(A3) 25(A6) 26(A7) 27(+5V) 28(RESET) 29(GND); J2 1(B+) 2(B-); O2sensor 2; Q4 1(D1) 2(S1) 3(S1) 4(G1) 5(G2) 6(S2) 7(S2) 8(D2); U1 2*; U1#2 2(ALRT) 4(A1) 5(A2) 6(A3); U2#2 1(In +) 2(In -); U3 4(TD); U5 2*; U6 2(ALRT) 4(A1) 5(A2) 6(A3); U7 2(ALRT) 4(A1) 5(A2) 6(A3); U15 A1(CTG) A2(CELL) A3(VDD) A4(GND) B1(SDA) B2(SCL) B3(QSTRT) B4(ALRT#); U17 1(GND) 2(GND) 3(VIN) 4(VIN) 5(GND) 6(GND) 7(OUT) 8(OUT); U18 1(CTG) 2(CELL) 3(VDD) 4(GND) 5(ALRT#) 6(QSTRT) 7(SCL) 8(SDA) 9(EP); U19 7(PGOOD#)*; U23 1(VINA) 2(GND) 3(FB) 4(VOUT) 5(VOUT) 6(L2) 7(L2) 8(L1) 9(L1) 10(VIN) 11(VIN) 12(EN) 13(PS/SYNC) 14(PG) 15(PGND); U24 1(OD) 2(CSI) 3(OC) 4(NC); U25 1(ADDR) 2(ALERT/RDY) 3(GND) 4(AIN0) 5(AIN1) 6(AIN2) 7(AIN3) 8(VDD) 9(SDA) 10(SCL)

## Notes on the sheets
sheet 1
- USB-C Input
- BATTERY MODULE
- He SENSOR
- GND and VCC correct?
- ADS1115
- O2 SENSOR
- HUM/TEMP SENSOR
sheet 3
- CHARGING MODULE
- BATTERY MODULE
- ADS1115
- He SENSOR
- GND and VCC correct?
- O2 SENSOR
- HUM/TEMP SENSOR
